# Altium schematic sheet KEA.SchDoc
size A4
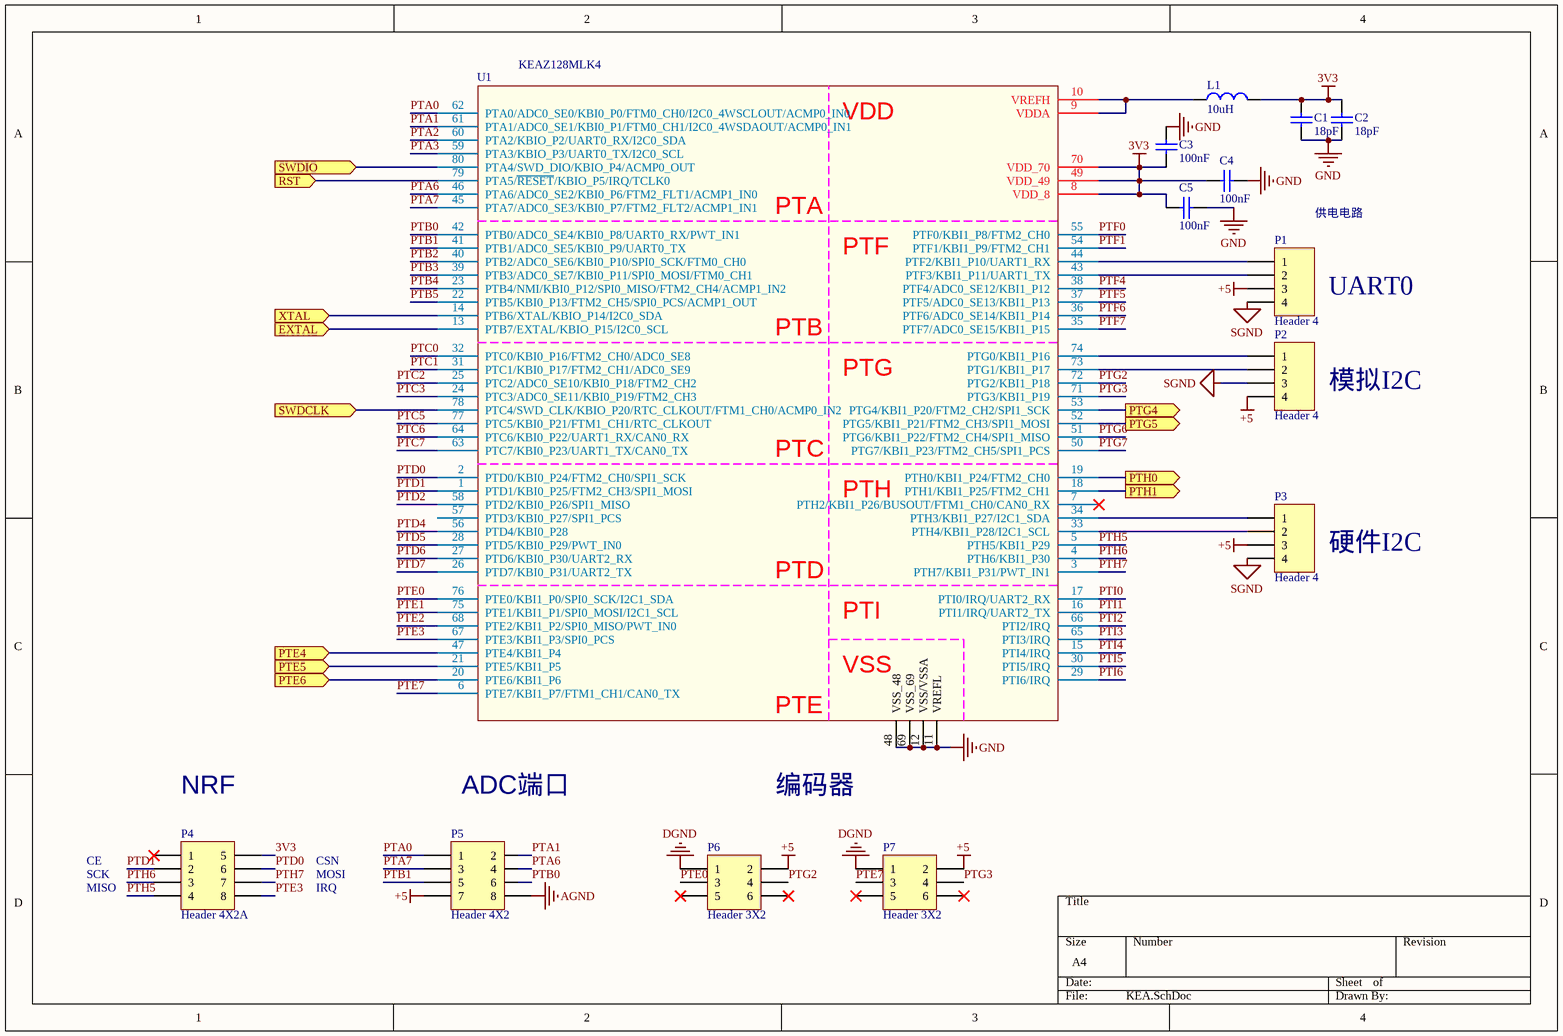
[diagram p0: KEA.SchDoc]

## Parts
C1  18pF  [0603]
C2  18pF  [0603]
C3  value 100nF  [0603]  (hidden comment: Cap)
C4  value 100nF  [0603]  (hidden comment: Cap)
C5  value 100nF  [0603]  (hidden comment: Cap)
L1  value 10uH  [1206]  (hidden comment: Inductor)
P1  Header 4  [HDR1X4]
P2  Header 4  [HDR1X4]
P3  Header 4  [HDR1X4]
P4  Header 4X2A  [HDR2X4_CEN]
P5  Header 4X2  [HDR2X4]
P6  Header 3X2  [HDR2X3]
P7  Header 3X2  [HDR2X3]
U1  KEAZ128MLK4  [TQFP65P1650X1650X150-80N]

## Ports
EXTAL (in), PTE4 (in), PTE5 (in), PTE6 (in), PTG4 (out), PTG5 (out), PTH0 (out), PTH1 (out), RST (in), SWDCLK (in), SWDIO (in), XTAL (in)

## Nets
3V3: C1.1 C2.1 C3.1 C4.1 C5.1 L1.2 P4.5 U1.8(VDD_8) U1.49(VDD_49) U1.70(VDD_70)
+5: P1.3 P2.4 P3.3 P5.7 P6.2 P7.2
AGND: P5.8
DGND: P6.1 P7.1
GND: C1.2 C2.2 C3.2 C4.2 C5.2 U1.11(VREFL) U1.12(VSS/VSSA) U1.48(VSS_48) U1.69(VSS_69)
SGND: P1.4 P2.3 P3.4
EXTAL: U1.13(PTB7/EXTAL/KBIO_P15/I2C0_SCL) ; port EXTAL
PTA0: P5.1 U1.62(PTA0/ADC0_SE0/KBI0_P0/FTM0_CH0/I2C0_4WSCLOUT/ACMP0_IN0)
PTA1: P5.2 U1.61(PTA1/ADC0_SE1/KBI0_P1/FTM0_CH1/I2C0_4WSDAOUT/ACMP0_IN1)
PTA2: U1.60(PTA2/KBIO_P2/UART0_RX/I2C0_SDA)
PTA3: U1.59(PTA3/KBIO_P3/UART0_TX/I2C0_SCL)
PTA6: P5.4 U1.46(PTA6/ADC0_SE2/KBI0_P6/FTM2_FLT1/ACMP1_IN0)
PTA7: P5.3 U1.45(PTA7/ADC0_SE3/KBI0_P7/FTM2_FLT2/ACMP1_IN1)
PTB0: P5.6 U1.42(PTB0/ADC0_SE4/KBI0_P8/UART0_RX/PWT_IN1)
PTB1: P5.5 U1.41(PTB1/ADC0_SE5/KBI0_P9/UART0_TX)
PTB2: U1.40(PTB2/ADC0_SE6/KBI0_P10/SPI0_SCK/FTM0_CH0)
PTB3: U1.39(PTB3/ADC0_SE7/KBI0_P11/SPI0_MOSI/FTM0_CH1)
PTB4: U1.23(PTB4/NMI/KBI0_P12/SPI0_MISO/FTM2_CH4/ACMP1_IN2)
PTB5: U1.22(PTB5/KBI0_P13/FTM2_CH5/SPI0_PCS/ACMP1_OUT)
PTC0: U1.32(PTC0/KBI0_P16/FTM2_CH0/ADC0_SE8)
PTC1: U1.31(PTC1/KBI0_P17/FTM2_CH1/ADC0_SE9)
PTC2: U1.25(PTC2/ADC0_SE10/KBI0_P18/FTM2_CH2)
PTC3: U1.24(PTC3/ADC0_SE11/KBI0_P19/FTM2_CH3)
PTC5: U1.77(PTC5/KBI0_P21/FTM1_CH1/RTC_CLKOUT)
PTC6: U1.64(PTC6/KBI0_P22/UART1_RX/CAN0_RX)
PTC7: U1.63(PTC7/KBI0_P23/UART1_TX/CAN0_TX)
PTD0: P4.6 U1.2(PTD0/KBI0_P24/FTM2_CH0/SPI1_SCK)
PTD1: P4.2 U1.1(PTD1/KBI0_P25/FTM2_CH3/SPI1_MOSI)
PTD2: U1.58(PTD2/KBI0_P26/SPI1_MISO)
PTD4: U1.56(PTD4/KBI0_P28)
PTD5: U1.28(PTD5/KBI0_P29/PWT_IN0)
PTD6: U1.27(PTD6/KBI0_P30/UART2_RX)
PTD7: U1.26(PTD7/KBI0_P31/UART2_TX)
PTE0: P6.3 U1.76(PTE0/KBI1_P0/SPI0_SCK/I2C1_SDA)
PTE1: U1.75(PTE1/KBI1_P1/SPI0_MOSI/I2C1_SCL)
PTE2: U1.68(PTE2/KBI1_P2/SPI0_MISO/PWT_IN0)
PTE3: P4.8 U1.67(PTE3/KBI1_P3/SPI0_PCS)
PTE4: U1.47(PTE4/KBI1_P4) ; port PTE4
PTE5: U1.21(PTE5/KBI1_P5) ; port PTE5
PTE6: U1.20(PTE6/KBI1_P6) ; port PTE6
PTE7: P7.3 U1.6(PTE7/KBI1_P7/FTM1_CH1/CAN0_TX)
PTF0: U1.55(PTF0/KBI1_P8/FTM2_CH0)
PTF1: U1.54(PTF1/KBI1_P9/FTM2_CH1)
PTF4: U1.38(PTF4/ADC0_SE12/KBI1_P12)
PTF5: U1.37(PTF5/ADC0_SE13/KBI1_P13)
PTF6: U1.36(PTF6/ADC0_SE14/KBI1_P14)
PTF7: U1.35(PTF7/ADC0_SE15/KBI1_P15)
PTG2: P6.4 U1.72(PTG2/KBI1_P18)
PTG3: P7.4 U1.71(PTG3/KBI1_P19)
PTG4: U1.53(PTG4/KBI1_P20/FTM2_CH2/SPI1_SCK) ; port PTG4
PTG5: U1.52(PTG5/KBI1_P21/FTM2_CH3/SPI1_MOSI) ; port PTG5
PTG6: U1.51(PTG6/KBI1_P22/FTM2_CH4/SPI1_MISO)
PTG7: U1.50(PTG7/KBI1_P23/FTM2_CH5/SPI1_PCS)
PTH0: U1.19(PTH0/KBI1_P24/FTM2_CH0) ; port PTH0
PTH1: U1.18(PTH1/KBI1_P25/FTM2_CH1) ; port PTH1
PTH5: P4.4 U1.5(PTH5/KBI1_P29)
PTH6: P4.3 U1.4(PTH6/KBI1_P30)
PTH7: P4.7 U1.3(PTH7/KBI1_P31/PWT_IN1)
PTI0: U1.17(PTI0/IRQ/UART2_RX)
PTI1: U1.16(PTI1/IRQ/UART2_TX)
PTI2: U1.66(PTI2/IRQ)
PTI3: U1.65(PTI3/IRQ)
PTI4: U1.15(PTI4/IRQ)
PTI5: U1.30(PTI5/IRQ)
PTI6: U1.29(PTI6/IRQ)
RST: U1.79(PTA5/~{RESET}/KBIO_P5/IRQ/TCLK0) ; port RST
SWDCLK: U1.78(PTC4/SWD_CLK/KBIO_P20/RTC_CLKOUT/FTM1_CH0/ACMP0_IN2) ; port SWDCLK
SWDIO: U1.80(PTA4/SWD_DIO/KBIO_P4/ACMP0_OUT) ; port SWDIO
XTAL: U1.14(PTB6/XTAL/KBIO_P14/I2C0_SDA) ; port XTAL
NetL1_1: L1.1 U1.9(VDDA) U1.10(VREFH)
NetP1_1: P1.1 U1.44(PTF2/KBI1_P10/UART1_RX)
NetP1_2: P1.2 U1.43(PTF3/KBI1_P11/UART1_TX)
NetP2_1: P2.1 U1.74(PTG0/KBI1_P16)
NetP2_2: P2.2 U1.73(PTG1/KBI1_P17)
NetP3_1: P3.1 U1.34(PTH3/KBI1_P27/I2C1_SDA)
NetP3_2: P3.2 U1.33(PTH4/KBI1_P28/I2C1_SCL)

Not connected (* = marked no-connect by the designer): P4 1*; P6 5* 6*; P7 5* 6*; U1 7(PTH2/KBI1_P26/BUSOUT/FTM1_CH0/CAN0_RX)* 57(PTD3/KBI0_P27/SPI1_PCS)

## Notes on the sheet
- 供电电路
- UART0
- 模拟I2C
- 硬件I2C
- NRF
- ADC端口
- 编码器
- MISO
- CE
- SCK
- IRQ
- MOSI
- CSN
- (in symbol SKEAZ128MLK4) VDD; PTA; PTF; PTB; PTG; PTC; PTH; PTD; PTI; VSS; PTE

## Library data of the parts
C1 C2 = Cap: Capacitor
C3-C5 = Cap: 无极性电容; Published: 8-Jun-2000; LatestRevisionDate: 17-Jul-2002; LatestRevisionNote: Re-released for DXP Platform.; PackageReference: RAD-0.3; Publisher: Altium Limited
L1 = Inductor: 电感; Code_IEC: 1005; Published: 8-Jun-2000; LatestRevisionDate: 17-Jul-2002; LatestRevisionNote: Re-released for DXP Platform.; PackageReference: 0402-A; Publisher: Altium Limited; Code_JEITA: 0402
P1-P3 = Header 4: Header, 4-Pin; LatestRevisionDate: 17-Jul-2002; LatestRevisionNote: Re-released for DXP Platform.; Publisher: Altium Limited
P4 = Header 4X2A: Header, 4-Pin, Dual row; LatestRevisionDate: 17-Jul-2002; LatestRevisionNote: Re-released for DXP Platform.; Publisher: Altium Limited
P5 = Header 4X2: Header, 4-Pin, Dual row; LatestRevisionDate: 17-Jul-2002; LatestRevisionNote: Re-released for DXP Platform.; Publisher: Altium Limited
P6 P7 = Header 3X2: Header, 3-Pin, Dual row; LatestRevisionDate: 17-Jul-2002; LatestRevisionNote: Re-released for DXP Platform.; Publisher: Altium Limited
U1 = SKEAZ128MLK4